# EasyEDA Pro project ch455_module.epro

# Schematic Schematic1
Board Name: Board1; Create Date: 2026-04-25; Page Name: P1; Project Name: ch445; Schematic Name: Schematic1; Update Date: 2026-05-02; Company: EasyEDA.com; Page Size: A4; Version: V1.0
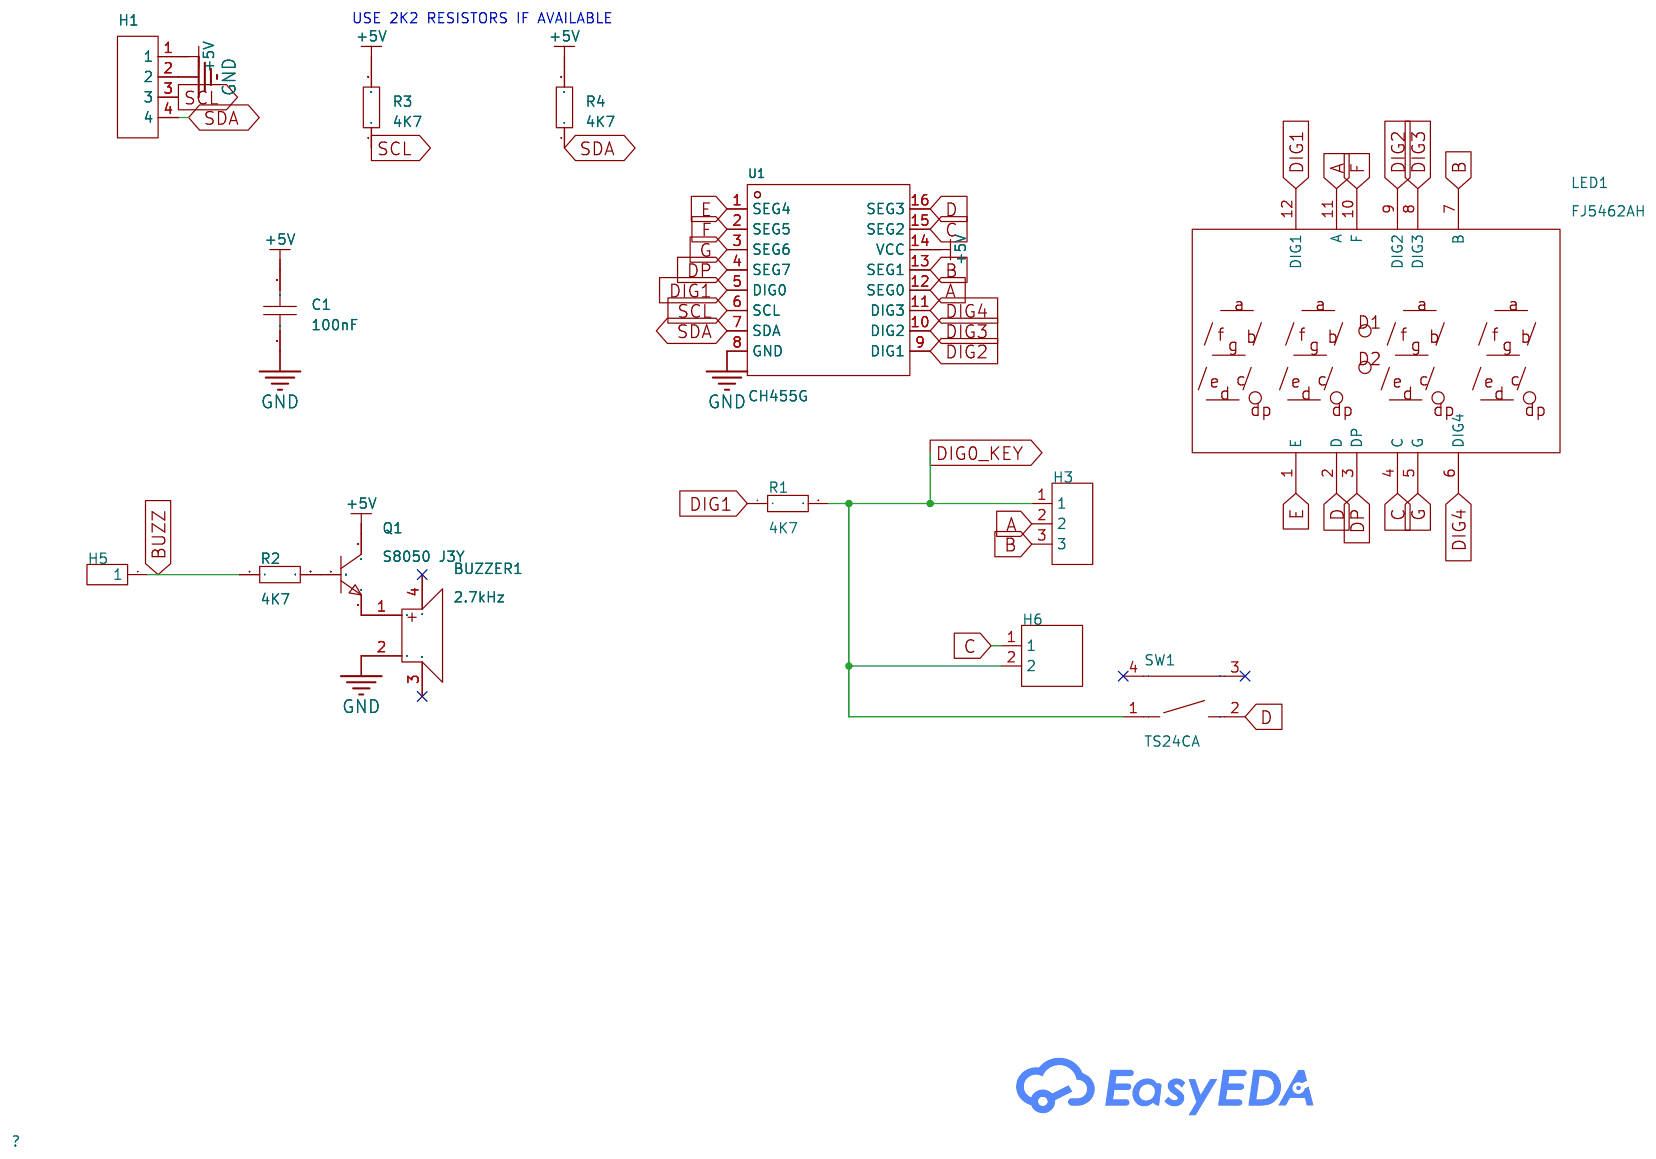
[diagram p0: schematic sheet]

## Parts
BUZZER1  2.7kHz  [BUZ-SMD_4P-L8.5-W8.5_FUET-8530-05]
C1  100nF  [C0603]
H1  -  [HDR-TH_4P-P2.54-V-M]
H3  -  [HDR-TH_3P-P2.54-V-M]
H5  -  [HDR-TH_1P-V-M_XKB_X4611WV-01I-C28D40]
H6  -  [HDR-TH_2P-P2.54-V-M-1]
LED1  FJ5462AH  [LED-SEG-TH_12P-L50.3-W19.0-P2.54-S15.24-BL]
Q1  S8050 J3Y  [SOT-23-3_L2.9-W1.3-P0.95-LS2.4-BR]
R1  4K7  [R0603]
R2  4K7  [R0603]
R3  4K7  [R0603]
R4  4K7  [R0603]
SW1  TS24CA  [SW-SMD_2P-TS24CA]
U1  CH455G  [SOP-16_L10.0-W3.9-P1.27-LS6.0-BL]

## Library data of the parts
BUZZER1 = SMD8530-32Ω: Driver Circuitry:Passive (Externally Driven) Technology:Electromagnetic Voltage Rating:5V Voltage - Supply:3V~6V Voltage - Supply:3V~6V Frequency:2.7kHz Current Consumption:100mA Sound Pressure Level(SPL):85dB Length:8.5mm Width:8.5mm Height:3mm; LCSC Part Name: 蜂鸣器; Supplier Part: C49246949; Manufacturer: XHXDZ(兴华鑫); Supplier Footprint: SMD,8.5x8.5mm; JLCPCB Part Class: Extended Part; Datasheet: https://item.szlcsc.com/datasheet/SMD8530-32%25CE%25A9/51674918.html; Supplier: LCSC; Driver Circuitry: Passive (Externally Driven); Technology: Electromagnetic; Voltage Rating: 5V; Voltage - Supply: 3V~6V; Current Consumption: 100mA; Sound Pressure Level(SPL): 85dB; Length: 8.5mm; Width: 8.5mm; Height: 3mm
C1 = CAP_0603: Supplier Footprint: 0603
H1 = HDR-M_2.54_1x4P: Supplier Footprint: Through
H3 = HDR-M_2.54_1x3P: Supplier Footprint: Through
H5 = HDR-M_2.54_1x1P: Supplier Footprint: Through
H6 = HDR-M_2.54_1x2P: Supplier Footprint: Through
LED1 = FJ5462AH: Number of Characters:4 Digit/Alpha Size(inch):0.56 Illumination Color:Red LED Polarity:Common Cathode; LCSC Part Name: 4位0.56英寸红色数码管 共阴极; Supplier Part: C46908; Manufacturer: 志浩; Supplier Footprint: 插件; JLCPCB Part Class: Extended Part; Datasheet: https://item.szlcsc.com/datasheet/FJ5462AH/47912.html; Supplier: LCSC; Number of Characters: 4; Digit/Alpha Size(inch): 0.56; Illumination Color: Red; LED Polarity: Common Cathode
Q1 = S8050 J3Y_C42441446: type:NPN Current - Collector(Ic):500mA Collector - Emitter Voltage VCEO:25V Pd - Power Dissipation:300mW Transition frequency(fT):150MHz Current - Collector Cutoff:100nA Vce Saturation(VCE(sat)):600mV; LCSC Part Name: hFE:120-200 S8050 J3Y; Supplier Part: C42441446; Manufacturer: TDSEMIC(拓电半导体); Supplier Footprint: SOT-23; JLCPCB Part Class: Extended Part; Datasheet: https://item.szlcsc.com/datasheet/S8050%2520J3Y/44491120.html; Supplier: LCSC; type: NPN; Current - Collector(Ic): 500mA; Collector - Emitter Voltage VCEO: 25V; Pd - Power Dissipation: 300mW; Transition frequency(fT): 150MHz; Current - Collector Cutoff: 100nA; Vce Saturation(VCE(sat)): 600mV
R1-R4 = Res_0603: Supplier Footprint: 0603
SW1 = TS24CA: Circuit:SPST Actuator Style:Rectangular Button Operating Force:1.6N Mounting Type:Surface Mount, Right Angle Length:4.7mm Width:1.9mm Switch Height:3.5mm with Bracket:Without Bracket Contact Current:50mA Voltage Rating:12V Actuator/Cap Color:Black With La; LCSC Part Name: 4.55*1.8*3.5mm 卧贴 轻触开关; Supplier Part: C393942; Manufacturer: SHOU HAN(首韩); Supplier Footprint: SMD,4.6x1.8mm; JLCPCB Part Class: Extended Part; Datasheet: https://item.szlcsc.com/datasheet/TS24CA/372554.html; Supplier: LCSC; Circuit: SPST; Actuator Style: Rectangular Button; Operating Force: 1.6N; Mounting Type: Surface Mount, Right Angle; Length: 4.7mm; Width: 1.9mm; Switch Height: 3.5mm; with Bracket: Without Bracket; Contact Current: 50mA; Voltage Rating: 12V; Actuator/Cap Color: Black; With Lamp: No; Termination Style: SMD(SMT) Tab; Life: 20,000 cycles; Operating Temperature: -20℃~+70℃
U1 = CH455G: Configuration:7 Segment × 4 Digit；8 Segment x 4 Digit Interface:I2C Voltage - Supply:2.7V~5V Voltage - Supply:2.7V~5V Clock Frequency:4MHz Quiescent Current:50uA Digit Drive Current:160mA Segment Drive Current:25mA Features:Key Scan；Common Cathode；Adjusta; LCSC Part Name: 数码管驱动及键盘控制芯片; Supplier Part: C89818; Manufacturer: WCH(南京沁恒); Supplier Footprint: SOP-16; JLCPCB Part Class: Extended Part; Datasheet: https://item.szlcsc.com/datasheet/CH455G/91000.html; Supplier: LCSC; Configuration: 7 Segment × 4 Digit；8 Segment x 4 Digit; Interface: I2C; Voltage - Supply: 2.7V~5V; Clock Frequency: 4MHz; Quiescent Current: 50uA; Digit Drive Current: 160mA; Segment Drive Current: 25mA; Features: Key Scan；Common Cathode；Adjustable Glow; Operating Temperature: -40℃~+85℃

## Nets
+5V: C1.1 H1.1 Q1.3(C) R3.2 R4.2 U1.14(VCC)
GND: BUZZER1.2 C1.2 H1.2 U1.8(GND)
A: H3.2 LED1.11(A) U1.12(SEG0)
B: H3.3 LED1.7(B) U1.13(SEG1)
BUZZ: H5.1 R2.1
C: H6.1 LED1.4(C) U1.15(SEG2)
D: LED1.2(D) SW1.2 U1.16(SEG3)
DIG0_KEY: H3.1 H6.2 R1.2 SW1.1
DIG1: LED1.12(DIG1) R1.1 U1.5(DIG0)
DIG2: LED1.9(DIG2) U1.9(DIG1)
DIG3: LED1.8(DIG3) U1.10(DIG2)
DIG4: LED1.6(DIG4) U1.11(DIG3)
DP: LED1.3(DP) U1.4(SEG7)
E: LED1.1(E) U1.1(SEG4)
F: LED1.10(F) U1.2(SEG5)
G: LED1.5(G) U1.3(SEG6)
SCL: H1.3 R3.1 U1.6(SCL)
SDA: H1.4 R4.1 U1.7(SDA)
$1N2079: BUZZER1.1 Q1.2(E)
$1N2210: Q1.1(B) R2.2

Not connected (* = marked no-connect by the designer): BUZZER1 3* 4*; SW1 3* 4*

## Notes on the sheet
- USE 2K2 RESISTORS IF AVAILABLE

# Board PCB1
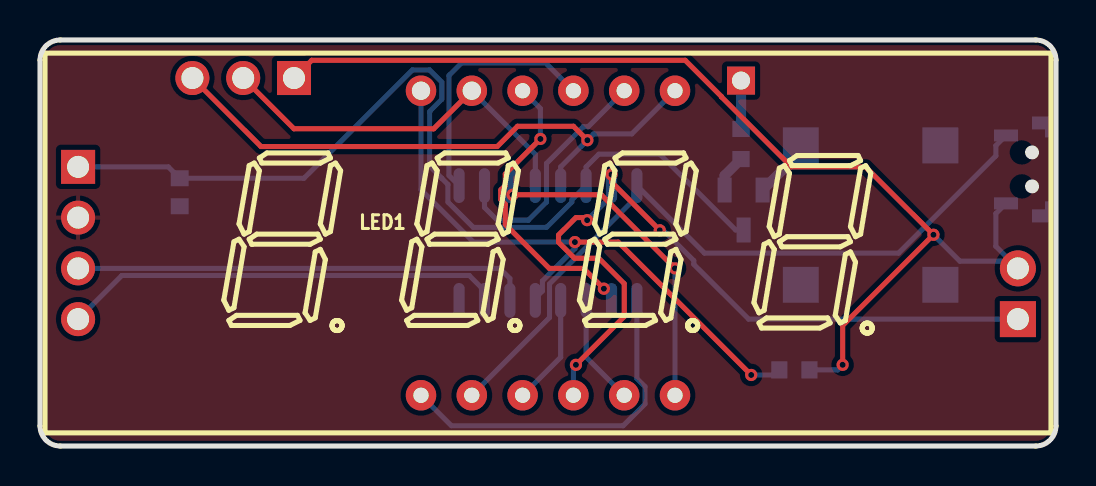
[diagram p1: board, top side]
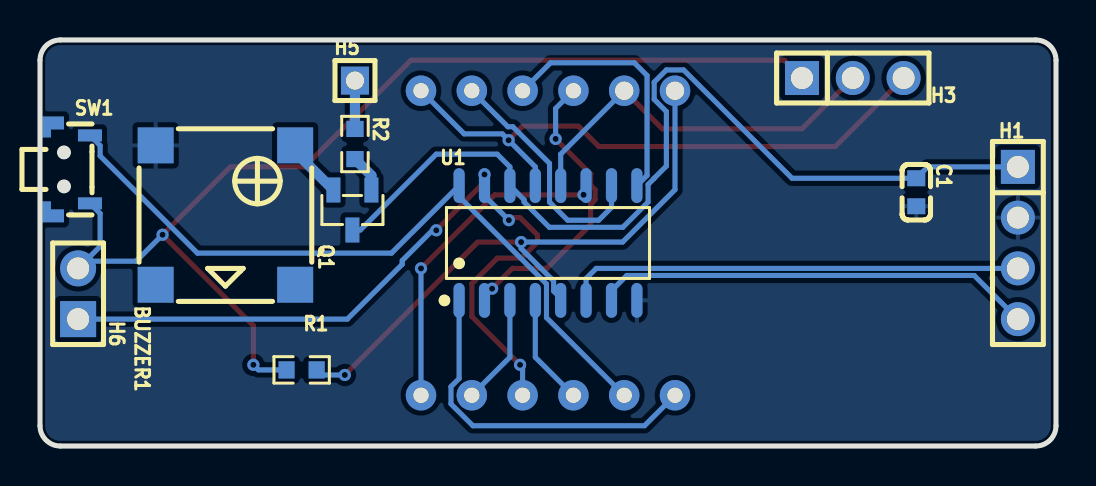
[diagram p2: board, bottom side, seen from below]

Outline 50.8 x 20.32 mm; copper layers: Top Layer, Bottom Layer. Coordinates in mm from the lower left corner of the outline.
Outline path: 0,19.3 0,1.02 arc(0.3,0.3) 1.02,0 49.78,0 arc(50.5,0.3) 50.8,1.02 50.8,19.3 arc(50.5,20.02) 49.78,20.32 1.02,20.32 arc(0.3,20.02) 0,19.3
Stack: Top Layer 0.035mm / Dielectric1 1.51mm FR4 er 4.5 / Bottom Layer 0.035mm

## Design rules (mm)
template: Custom Config
spacing copperThickness1oz (default): track to track 0.102, other pairs 0.152 to 0.3
spacing copperThickness2oz: track to track 0.203, other pairs 0.152 to 0.3
track width copperThickness1oz (default): min 0.127, default 0.254, max 2.54
track width copperThickness2oz: min 0.203, default 0.254, max 2.54
differential pair differentialPair (default): width min 0.127, default 0.254, max 2.54; gap min 0.152, default 0.152
via viaSize (default): diameter min 0.5, default 0.61, max 10; hole min 0.3, default 0.305, max 6.3

## Placement (name value [footprint] x y rotation side)
BUZZER1  2.7kHz  [BUZ-SMD_4P-L8.5-W8.5_FUET-8530-05]  41.53 11.56 90 bottom
C1  100nF  [C0603]  6.99 12.7 270 bottom
H1  -  [HDR-TH_4P-P2.54-V-M]  1.91 10.16 270 bottom
H3  -  [HDR-TH_3P-P2.54-V-M]  10.16 18.41 180 bottom
H5  -  [HDR-TH_1P-V-M_XKB_X4611WV-01I-C28D40]  35.05 18.29 180 bottom
H6  -  [HDR-TH_2P-P2.54-V-M-1]  48.9 7.62 90 bottom
LED1  FJ5462AH  [LED-SEG-TH_12P-L50.3-W19.0-P2.54-S15.24-BL]  25.4 10.16 0 top
Q1  S8050 J3Y  [SOT-23-3_L2.9-W1.3-P0.95-LS2.4-BR]  35.18 11.81 90 bottom
R1  4K7  [R0603]  37.72 3.81 0 bottom
R2  4K7  [R0603]  35.05 15.11 270 bottom
SW1  TS24CA  [SW-SMD_2P-TS24CA]  49.28 13.84 90 bottom
U1  CH455G  [SOP-16_L10.0-W3.9-P1.27-LS6.0-BL]  25.4 10.16 180 bottom

## Footprints (pads in the part's own frame, mm; a bottom-side part is the same pattern mirrored in y, then rotated)
BUZ-SMD_4P-L8.5-W8.5_FUET-8530-05
  rect 1.8x1.8 smd: 1(3.488,-3.488) 2(3.488,3.488) 3(-3.488,3.488) 4(-3.488,-3.488)
C0603
  rect 0.8x0.9 smd: 1(-0.7,0) 2(0.7,0)
HDR-TH_1P-V-M_XKB_X4611WV-01I-C28D40
  rect 1.4x1.4 hole 0.9: 1(0,0)
HDR-TH_2P-P2.54-V-M-1
  rect 1.8x1.8 hole 1.1: 1(-1.27,0)
  round 1.8 hole 1.1: 2(1.27,0)
HDR-TH_3P-P2.54-V-M
  rect 1.7x1.7 hole 1.1: 1(-2.54,0)
  round 1.7 hole 1.1: 2(0,0) 3(2.54,0)
HDR-TH_4P-P2.54-V-M
  rect 1.7x1.7 hole 1.1: 1(-3.81,0)
  round 1.7 hole 1.1: 2(-1.27,0) 3(1.27,0) 4(3.81,0)
LED-SEG-TH_12P-L50.3-W19.0-P2.54-S15.24-BL
  round 1.524 hole 0.762: 1(-6.35,-7.62) 2(-3.81,-7.62) 3(-1.27,-7.62) 4(1.27,-7.62) 5(3.81,-7.62) 6(6.35,-7.62) 7(6.35,7.62) 8(3.81,7.62) 9(1.27,7.62) 10(-1.27,7.62)
  round 1.524 hole 0.914: 11(-3.81,7.62) 12(-6.35,7.62)
R0603
  rect 0.806x0.864 smd: 1(-0.753,0) 2(0.753,0)
SOP-16_L10.0-W3.9-P1.27-LS6.0-BL
  oval 0.56x1.745 smd: 1(-4.445,-2.873) 2(-3.175,-2.873) 3(-1.905,-2.873) 4(-0.635,-2.873) 5(0.635,-2.873) 6(1.905,-2.873) 7(3.175,-2.873) 8(4.445,-2.873) 9(4.445,2.873) 10(3.175,2.873) 11(1.905,2.873) 12(0.635,2.873) 13(-0.635,2.873) 14(-1.905,2.873) 15(-3.175,2.873) 16(-4.445,2.873)
SOT-23-3_L2.9-W1.3-P0.95-LS2.4-BR
  rect 1.25x0.7 smd: 1(1,-0.95) 2(1,0.95) 3(-1,0)
SW-SMD_2P-TS24CA
  rect 0.6x1.2 smd: 1(-1.7,-0.975) 2(1.7,-0.975)
  custom 1.05x1.3 smd: 3(2.125,0.975) 4(-2.125,0.975)

## Nets
As in the schematic, except:
$1N1399: H3.1 H6.2 R1.2 SW1.1
$1N2232: H5.1 R2.1

Pads without a net: BUZZER1 3 4; SW1 3 4

## Via types
v1: diameter 0.61, hole 0.305, Top Layer to Bottom Layer, 13 vias

## Routing (per net, layer and track width the routed paths; a pad name or vN(x,y) marks a point on that pad's centre or on a via; arc(x,y) is an arc through that point)
+5V: length 46.6
  Bottom Layer w0.254: Q1.3 34.78,10.81 30.99,14.6 27.94,14.6 27.31,13.97 U1.14 26.59,12.32 26.59,12.21 25.33,10.94 21.66,10.94 20.4,12.21 20.4,13.09 20.09,13.39 20.09,13.4 19.48,14.01 19.48,16.74 20.09,17.35 20.09,18.21 19.48,18.82 18.62,18.82 13.2,13.4 C1.1 6.41,13.97 H1.1
A: length 19.3
  Top Layer w0.254: LED1.11 19.69,15.88 12.7,15.88 H3.2
  Bottom Layer w0.254: LED1.11 24.77,14.6 U1.12
B: length 30.1
  Top Layer w0.254: v1(27.37,15.3) 26.67,16 23.88,16 22.86,14.99 11.05,14.99 H3.3
  Bottom Layer w0.254: LED1.7 29.59,15.62 27.69,15.62 v1(27.37,15.3) 26.03,13.97 U1.13
C: length 38.9
  Top Layer w0.254: v1(27.36,11.3) 27.23,11.43 26.8,11.43 25.93,10.56 25.93,10.2 26.73,9.4 27.94,9.4 29.21,8.13 29.21,6.48 v1(26.8,4.06) ; v1(30.99,10.8) 28.58,13.21 v1(28.58,13.59)
  Bottom Layer w0.254: v1(26.8,4.06) 26.67,3.94 LED1.4 ; v1(27.36,11.3) 28.58,12.52 U1.15 ; H6.1 35.43,6.35 32.69,9.09 32.69,9.28 31.17,10.8 v1(30.99,10.8)
D: length 36.5
  Bottom Layer w0.254: LED1.2 25.48,6.43 25.48,8.11 29.84,12.48 U1.16 33.23,9.65 42.93,9.65 47.79,14.52 47.79,15.03 SW1.2
DIG1: length 30.6
  Top Layer w0.254: v1(35.56,3.56) 28.91,10.21 v1(26.74,10.21)
  Bottom Layer w0.254: LED1.12 19.05,12.83 21.67,10.21 v1(26.74,10.21) 26.74,9.88 25.12,8.26 25.12,7.76 24.77,7.4 U1.5 ; R1.1 36.71,3.56 v1(35.56,3.56)
DIG2: length 12.8
  Bottom Layer w0.254: LED1.9 25.27,19.18 21.08,19.18 20.45,18.54 20.45,13.54 U1.9
DIG3: length 12.2
  Bottom Layer w0.254: U1.10 22.22,11.94 22.86,11.3 24.41,11.3 25.32,12.21 25.32,14.14 27.16,15.98 27.41,15.98 LED1.8
DIG4: length 16.5
  Top Layer w0.254: v1(23.62,12.57) 28.07,12.57 v1(31.75,8.89)
  Bottom Layer w0.254: v1(23.62,12.57) 23.5,12.7 U1.11 ; LED1.6 v1(31.75,8.89)
DP: length 5.5
  Bottom Layer w0.254: U1.4 26.03,4.44 LED1.3
E: length 17.6
  Bottom Layer w0.254: U1.1 29.84,3.38 30.25,2.97 30.25,2.11 29.16,1.02 20.57,1.02 LED1.1
F: length 15
  Top Layer w0.254: v1(25.02,15.37) 23.27,13.61 23.27,13.04 23.04,12.81 23.04,12.33 23.27,12.1 23.27,11.09 25.46,8.89 27.18,8.89 v1(28.19,7.87)
  Bottom Layer w0.254: v1(25.02,15.37) 25.02,16.89 LED1.10 ; v1(28.19,7.87) 28.58,7.49 U1.2
G: length 5.5
  Bottom Layer w0.254: U1.3 27.31,4.44 LED1.5
SCL: length 22.9
  Bottom Layer w0.254: H1.3 22.99,8.89 23.5,8.38 U1.6
SDA: length 22
  Bottom Layer w0.254: U1.7 22.22,7.77 21.46,8.53 4.09,8.53 H1.4
$1N1399: length 54.5
  Top Layer w0.254: H3.1 13.59,19.3 32.26,19.3 34.07,17.49 34.07,17.47 37.58,13.97 41.28,13.97 v1(44.67,10.57) 40.13,6.03 v1(40.13,4.06)
  Bottom Layer w0.254: 48.54,9.25 47.79,9.99 47.79,11.63 SW1.1 ; 48.54,9.25 46,9.25 v1(44.67,10.57) ; 48.54,9.25 H6.2 ; R1.2 39.88,3.81 v1(40.13,4.06)
$1N2079: length 3
  Bottom Layer w0.508: Q1.2 38.04,14.72 BUZZER1.1
$1N2210: length 1.9
  Bottom Layer w0.508: R2.2 34.23,13.54 Q1.1
$1N2232: length 2.4
  Bottom Layer w0.508: H5.1 R2.1

## Copper pours and planes (outline as drawn; the poured copper is in the pictures)
GND on Top Layer: -3.3,25.78 52.71,25.78 52.71,-2.67 -3.3,-2.67
GND on Bottom Layer: -1.27,21.34 51.56,21.34 51.56,-1.27 -1.27,-1.27
